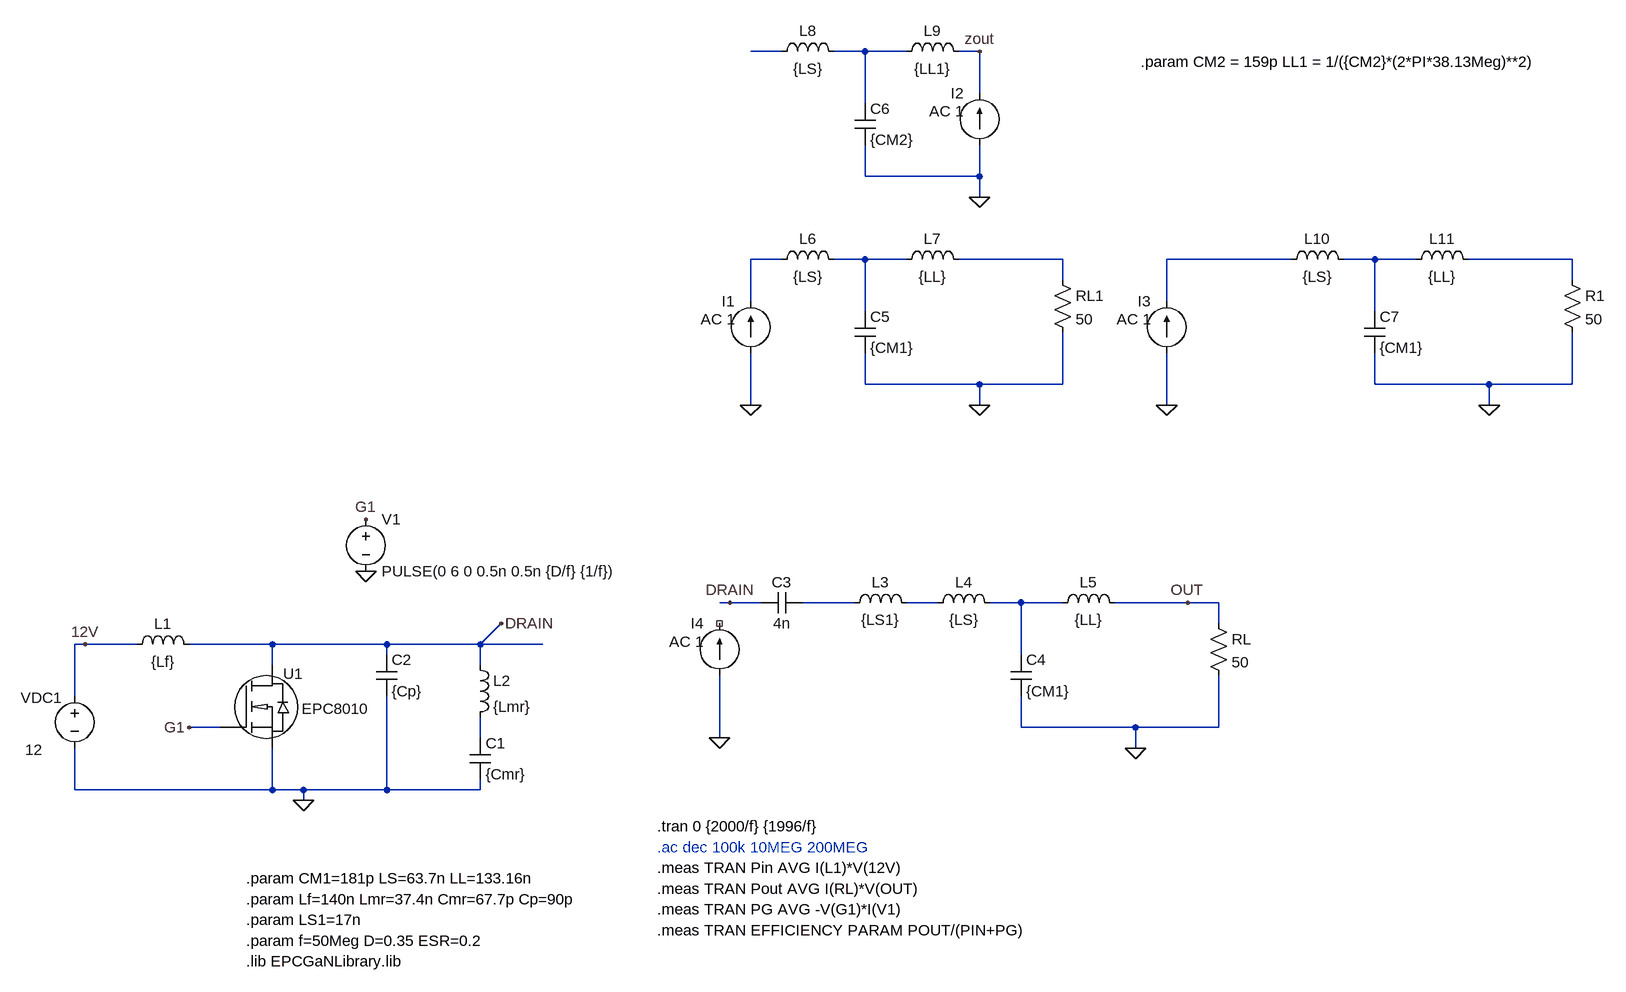
[diagram p0: schematic phi_2_50MHz_EPC8010.asc]
phi_2_50MHz_EPC8010.asc, the LTspice schematic file:
Version 4
SHEET 1 1668 680
WIRE 384 -896 336 -896
WIRE 512 -896 464 -896
WIRE 576 -896 512 -896
WIRE 688 -896 656 -896
WIRE 688 -832 688 -896
WIRE 512 -816 512 -896
WIRE 512 -704 512 -752
WIRE 688 -704 688 -752
WIRE 688 -704 512 -704
WIRE 688 -672 688 -704
WIRE 384 -576 336 -576
WIRE 512 -576 464 -576
WIRE 576 -576 512 -576
WIRE 816 -576 656 -576
WIRE 1168 -576 976 -576
WIRE 1296 -576 1248 -576
WIRE 1360 -576 1296 -576
WIRE 1600 -576 1440 -576
WIRE 816 -544 816 -576
WIRE 1600 -544 1600 -576
WIRE 336 -512 336 -576
WIRE 976 -512 976 -576
WIRE 512 -496 512 -576
WIRE 1296 -496 1296 -576
WIRE 512 -384 512 -432
WIRE 688 -384 512 -384
WIRE 816 -384 816 -464
WIRE 816 -384 688 -384
WIRE 1296 -384 1296 -432
WIRE 1472 -384 1296 -384
WIRE 1600 -384 1600 -464
WIRE 1600 -384 1472 -384
WIRE 336 -352 336 -432
WIRE 688 -352 688 -384
WIRE 976 -352 976 -432
WIRE 1472 -352 1472 -384
WIRE 304 -48 288 -48
WIRE 352 -48 304 -48
WIRE 496 -48 416 -48
WIRE 624 -48 576 -48
WIRE 752 -48 704 -48
WIRE 816 -48 752 -48
WIRE 1008 -48 896 -48
WIRE 1056 -48 1008 -48
WIRE 1056 -16 1056 -48
WIRE -688 16 -704 16
WIRE -608 16 -688 16
WIRE -400 16 -528 16
WIRE -224 16 -400 16
WIRE -80 16 -48 -16
WIRE -80 16 -224 16
WIRE 16 16 -80 16
WIRE -224 32 -224 16
WIRE 752 32 752 -48
WIRE -400 48 -400 16
WIRE -80 48 -80 16
WIRE -704 96 -704 16
WIRE -480 144 -528 144
WIRE 752 144 752 96
WIRE 928 144 752 144
WIRE 1056 144 1056 64
WIRE 1056 144 928 144
WIRE -80 160 -80 128
WIRE 288 160 288 64
WIRE 928 176 928 144
WIRE -704 240 -704 176
WIRE -400 240 -400 176
WIRE -400 240 -704 240
WIRE -352 240 -400 240
WIRE -224 240 -224 96
WIRE -224 240 -352 240
WIRE -80 240 -80 224
WIRE -80 240 -224 240
WIRE -352 256 -352 240
FLAG -688 16 12V
FLAG -256 -176 G1
FLAG -256 -96 0
FLAG -48 -16 DRAIN
FLAG -352 256 0
FLAG 1008 -48 OUT
FLAG 928 176 0
FLAG 688 -352 0
FLAG 336 -352 0
FLAG 688 -672 0
FLAG 688 -896 zout
FLAG 1472 -352 0
FLAG 976 -352 0
FLAG -528 144 G1
FLAG 288 160 0
FLAG 304 -48 DRAIN
SYMBOL voltage -704 80 R0
WINDOW 123 0 0 Left 0
WINDOW 39 0 0 Left 0
WINDOW 0 -83 18 Left 2
WINDOW 3 -76 98 Left 2
SYMATTR InstName VDC1
SYMATTR Value 12
SYMBOL cap -96 224 M180
WINDOW 0 24 56 Left 2
WINDOW 3 24 8 Left 2
SYMATTR InstName C1
SYMATTR Value {Cmr}
SYMBOL ind -624 32 R270
WINDOW 0 32 56 VTop 2
WINDOW 3 5 56 VBottom 2
SYMATTR InstName L1
SYMATTR Value {Lf}
SYMATTR SpiceLine Rser={ESR}
SYMBOL ind -96 32 R0
SYMATTR InstName L2
SYMATTR Value {Lmr}
SYMATTR SpiceLine Rser={ESR}
SYMBOL cap -240 32 R0
SYMATTR InstName C2
SYMATTR Value {Cp}
SYMBOL voltage -256 -192 R0
WINDOW 123 0 0 Left 0
WINDOW 39 0 0 Left 0
SYMATTR InstName V1
SYMATTR Value PULSE(0 6 0 0.5n 0.5n {D/f} {1/f})
SYMBOL EPCGaN -480 144 R0
WINDOW 0 97 -83 Left 2
WINDOW 3 125 -29 Left 2
SYMATTR InstName U1
SYMATTR Value EPC8010
SYMBOL res 1040 -32 R0
SYMATTR InstName RL
SYMATTR Value 50
SYMBOL ind 480 -32 R270
WINDOW 0 32 56 VTop 2
WINDOW 3 5 56 VBottom 2
SYMATTR InstName L3
SYMATTR Value {LS1}
SYMATTR SpiceLine Rser={ESR}
SYMBOL ind 608 -32 R270
WINDOW 0 32 56 VTop 2
WINDOW 3 5 56 VBottom 2
SYMATTR InstName L4
SYMATTR Value {LS}
SYMBOL cap 736 32 R0
SYMATTR InstName C4
SYMATTR Value {CM1}
SYMBOL ind 800 -32 R270
WINDOW 0 32 56 VTop 2
WINDOW 3 5 56 VBottom 2
SYMATTR InstName L5
SYMATTR Value {LL}
SYMATTR SpiceLine Rser={ESR}
SYMBOL res 800 -560 R0
SYMATTR InstName RL1
SYMATTR Value 50
SYMBOL ind 368 -560 R270
WINDOW 0 32 56 VTop 2
WINDOW 3 5 56 VBottom 2
SYMATTR InstName L6
SYMATTR Value {LS}
SYMBOL cap 496 -496 R0
SYMATTR InstName C5
SYMATTR Value {CM1}
SYMBOL ind 560 -560 R270
WINDOW 0 32 56 VTop 2
WINDOW 3 5 56 VBottom 2
SYMATTR InstName L7
SYMATTR Value {LL}
SYMATTR SpiceLine Rser={ESR}
SYMBOL current 336 -432 R180
WINDOW 0 24 80 Left 2
WINDOW 3 24 0 Left 2
WINDOW 123 24 52 Left 2
WINDOW 39 0 0 Left 0
SYMATTR InstName I1
SYMATTR Value ""
SYMATTR Value2 AC 1
SYMBOL ind 368 -880 R270
WINDOW 0 32 56 VTop 2
WINDOW 3 5 56 VBottom 2
SYMATTR InstName L8
SYMATTR Value {LS}
SYMBOL cap 496 -816 R0
SYMATTR InstName C6
SYMATTR Value {CM2}
SYMBOL ind 560 -880 R270
WINDOW 0 32 56 VTop 2
WINDOW 3 5 56 VBottom 2
SYMATTR InstName L9
SYMATTR Value {LL1}
SYMATTR SpiceLine Rser={ESR}
SYMBOL current 688 -752 R180
WINDOW 0 24 80 Left 2
WINDOW 3 24 0 Left 2
WINDOW 123 24 52 Left 2
WINDOW 39 0 0 Left 0
SYMATTR InstName I2
SYMATTR Value ""
SYMATTR Value2 AC 1
SYMBOL ind 1152 -560 R270
WINDOW 0 32 56 VTop 2
WINDOW 3 5 56 VBottom 2
SYMATTR InstName L10
SYMATTR Value {LS}
SYMBOL cap 1280 -496 R0
SYMATTR InstName C7
SYMATTR Value {CM1}
SYMBOL ind 1344 -560 R270
WINDOW 0 32 56 VTop 2
WINDOW 3 5 56 VBottom 2
SYMATTR InstName L11
SYMATTR Value {LL}
SYMATTR SpiceLine Rser={ESR}
SYMBOL current 976 -432 R180
WINDOW 0 24 80 Left 2
WINDOW 3 24 0 Left 2
WINDOW 123 24 52 Left 2
WINDOW 39 0 0 Left 0
SYMATTR InstName I3
SYMATTR Value ""
SYMATTR Value2 AC 1
SYMBOL res 1584 -560 R0
SYMATTR InstName R1
SYMATTR Value 50
SYMBOL current 288 64 R180
WINDOW 0 24 80 Left 2
WINDOW 3 24 0 Left 2
WINDOW 123 24 52 Left 2
WINDOW 39 0 0 Left 0
SYMATTR InstName I4
SYMATTR Value ""
SYMATTR Value2 AC 1
SYMBOL cap 416 -64 R90
WINDOW 0 0 32 VBottom 2
WINDOW 3 32 32 VTop 2
SYMATTR InstName C3
SYMATTR Value 4n
TEXT -440 472 Left 2 !.param f=50Meg D=0.35 ESR=0.2
TEXT -440 440 Left 2 !.param LS1=17n
TEXT 192 296 Left 2 !.tran 0 {2000/f} {1996/f}
TEXT -440 504 Left 2 !.lib EPCGaNLibrary.lib
TEXT 192 328 Left 2 ;.ac dec 100k 10MEG 200MEG
TEXT 192 360 Left 2 !.meas TRAN Pin AVG I(L1)*V(12V)
TEXT 192 392 Left 2 !.meas TRAN Pout AVG I(RL)*V(OUT)
TEXT 192 424 Left 2 !.meas TRAN PG AVG -V(G1)*I(V1)
TEXT 192 456 Left 2 !.meas TRAN EFFICIENCY PARAM POUT/(PIN+PG)
TEXT -440 376 Left 2 !.param CM1=181p LS=63.7n LL=133.16n
TEXT -440 408 Left 2 !.param Lf=140n Lmr=37.4n Cmr=67.7p Cp=90p
TEXT 936 -880 Left 2 !.param CM2 = 159p LL1 = 1/({CM2}*(2*PI*38.13Meg)**2)

The netlist it stands for:
* phi_2_50MHz_EPC8010.asc
VDC1 12V 0 12
C1 0 N012 {Cmr}
L1 12V DRAIN {Lf} Rser={ESR}
L2 DRAIN N012 {Lmr} Rser={ESR}
C2 DRAIN 0 {Cp}
V1 G1 0 PULSE(0 6 0 0.5n 0.5n {D/f} {1/f})
XU1 G1 DRAIN 0 EPC8010  ; pins gatein drainin N_0
RL OUT 0 50
L3 N009 N010 {LS1} Rser={ESR}
L4 N010 N011 {LS}
C4 N011 0 {CM1}
L5 N011 OUT {LL} Rser={ESR}
RL1 N005 0 50
L6 N003 N004 {LS}
C5 N004 0 {CM1}
L7 N004 N005 {LL} Rser={ESR}
I1 0 N003 AC 1
L8 N001 N002 {LS}
C6 N002 0 {CM2}
L9 N002 zout {LL1} Rser={ESR}
I2 0 zout AC 1
L10 N006 N007 {LS}
C7 N007 0 {CM1}
L11 N007 N008 {LL} Rser={ESR}
I3 0 N006 AC 1
R1 N008 0 50
I4 0 NC_01 AC 1
C3 N009 DRAIN 4n
.param f=50Meg D=0.35 ESR=0.2
.param LS1=17n
.tran 0 {2000/f} {1996/f}
.lib EPCGaNLibrary.lib
* .ac dec 100k 10MEG 200MEG
.meas TRAN Pin AVG I(L1)*V(12V)
.meas TRAN Pout AVG I(RL)*V(OUT)
.meas TRAN PG AVG -V(G1)*I(V1)
.meas TRAN EFFICIENCY PARAM POUT/(PIN+PG)
.param CM1=181p LS=63.7n LL=133.16n
.param Lf=140n Lmr=37.4n Cmr=67.7p Cp=90p
.param CM2 = 159p LL1 = 1/({CM2}*(2*PI*38.13Meg)**2)
.lib EPCGanlibrary.lib
.backanno
.end